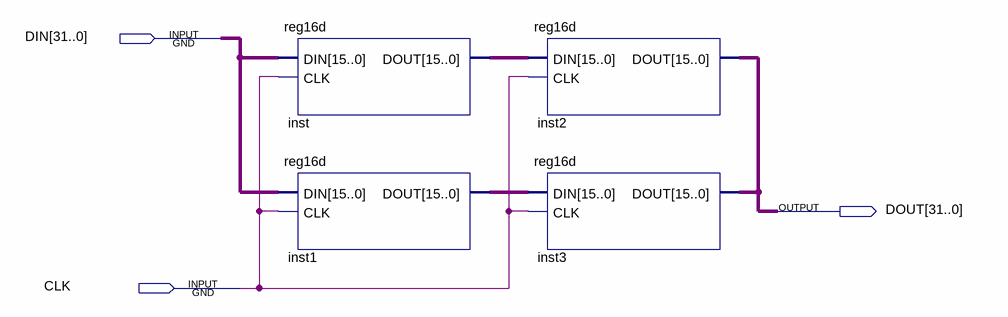
[diagram p0: schematic sheet]
// Quartus schematic reg32d2.bdf as structural Verilog: 4 symbols, 3 pins
module reg32d2 (
  input  [31:0] DIN,
  input  CLK,
  output [31:0] DOUT
);

  wire [15:0] inst1_dout, inst_dout;

  reg16d inst (.DIN(DIN[15:0]), .CLK(CLK), .DOUT(inst_dout));
  reg16d inst1 (.DIN(DIN[31:16]), .CLK(CLK), .DOUT(inst1_dout));
  reg16d inst2 (.DIN(inst_dout), .CLK(CLK), .DOUT(DOUT[15:0]));
  reg16d inst3 (.DIN(inst1_dout), .CLK(CLK), .DOUT(DOUT[31:16]));
endmodule
